# Altium schematic sheet [SCH]_Power.SchDoc: MOTHERBOARD
size 297 x 209 mm; CheckedBy: THIEN-KEMC; CompanyName: TEAM GA MO; DrawnBy: Vo Hao Hao; Organization: TEAM GA MO; Address1: TEAM GA MO Limited; Address2: 30, Nhat Hamet, Thanh Hoa, Phung Hiep, HG; TGM_Number: TGA-00005-01-1; Projet: EGG INCUBATION (PC-BASED MEASUREMENT AND CONTROL SYSTEMS); ModifiedBy: -; CreateDate: XX/XX/XXXX; CheckedDate: -; Title2: POWER SUPPLY LV; DivGrp: TGM; Designer: Vo Hao Hao
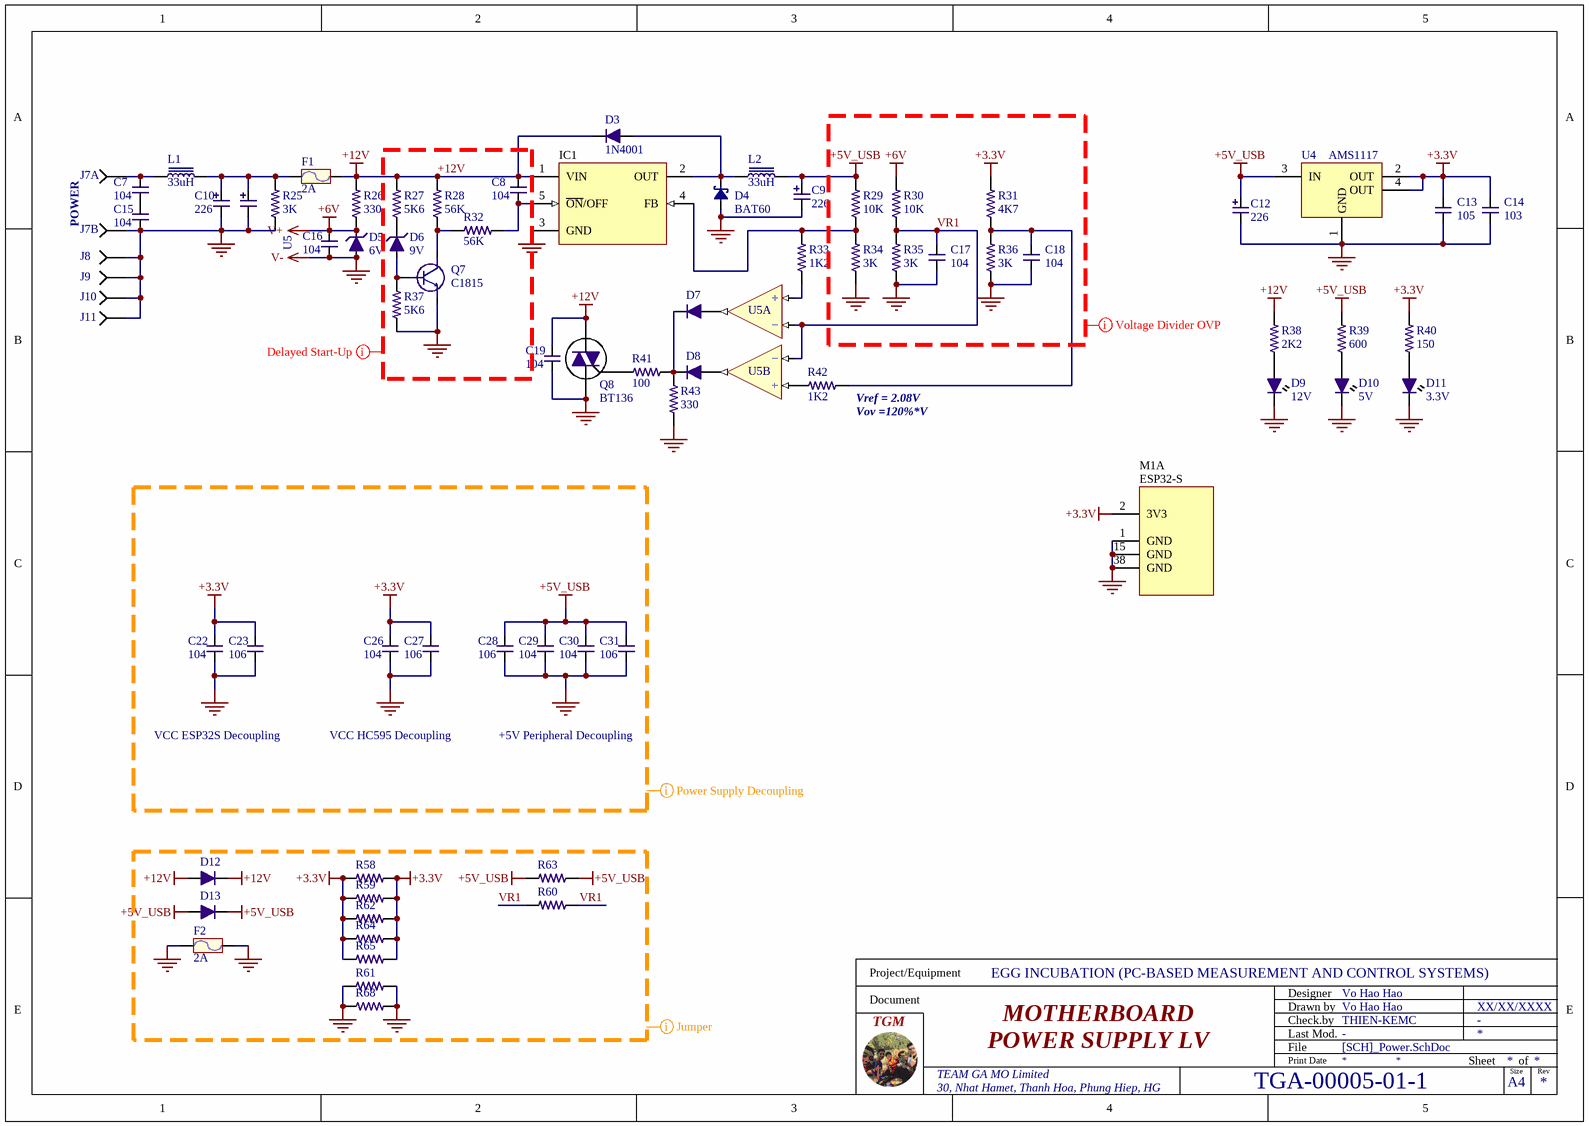
[diagram p0: [SCH]_Power.SchDoc]

## Parts
C7  104  [CAP-SMD-0805]
C8  104  [CAP-SMD-0805]
C9  226  [CAP-SMD-2512]
C10  226  [CAP-SMD-2512]
C11  226  [CAP-SMD-2512]  (value not drawn)
C12  226  [CAP-SMD-2512]
C13  105  [CAP-SMD-0805]
C14  103  [CAP-SMD-0805]
C15  104  [CAP-SMD-0805]
C16  104  [CAP-SMD-0805]
C17  104  [CAP-SMD-0805]
C18  104  [CAP-SMD-0805]
C19  104  [CAP-SMD-0805]
C22  104  [CAP-SMD-0805]
C23  106  [CAP-SMD-0805]
C26  104  [CAP-SMD-0805]
C27  106  [CAP-SMD-0805]
C28  106  [CAP-SMD-0805]
C29  104  [CAP-SMD-0805]
C30  104  [CAP-SMD-0805]
C31  106  [CAP-SMD-0805]
D3  1N4001  [DIO-SMD-123]
D4  BAT60  [DIO-SMD-106]
D5  6V  [DIO-SMD-123]
D6  9V  [DIO-SMD-123]
D7  1N4001  [DIO-SMD-123]  (value not drawn)
D8  1N4001  [DIO-SMD-123]  (value not drawn)
D9  12V  [LED0603-IPC]
D10  5V  [LED0603-IPC]
D11  3.3V  [LED0603-IPC]
D12  1N4001  [DIO-SMD-123]  (value not drawn)
D13  1N4001  [DIO-SMD-123]  (value not drawn)
F1  2A  [Fuse-SMD 1813]
F2  2A  [Fuse-SMD 1813]
IC1  LM2596  [TO263]  (value not drawn)
J7  POWER  [KF2/5.08]  (value not drawn)  (parts A,B of 2)
J8  MASS 3MM  [MY_PAD_3MM]  (value not drawn)
J9  MASS 3MM  [MY_PAD_3MM]  (value not drawn)
J10  MASS 3MM  [MY_PAD_3MM]  (value not drawn)
J11  MASS 3MM  [MY_PAD_3MM]  (value not drawn)
L1  33uH  [5026_INDUCTOR]
L2  33uH  [5026_INDUCTOR]
M1  ESP32-S  [ESP32-S-Footprint]  (part A of 4)
Q7  C1815  [SOT23(123)]
Q8  BT136  [TO252AA]
R25  value 3K  [RES-SMD-0805]  (hidden comment: R0805)
R26  value 330  [RES-SMD-0805]  (hidden comment: R0805)
R27  value 5K6  [RES-SMD-0805]  (hidden comment: R0805)
R28  value 56K  [RES-SMD-0805]  (hidden comment: R0805)
R29  value 10K  [RES-SMD-0805]  (hidden comment: R0805)
R30  value 10K  [RES-SMD-0805]  (hidden comment: R0805)
R31  value 4K7  [RES-SMD-0805]  (hidden comment: R0805)
R32  value 56K  [RES-SMD-0805]  (hidden comment: R0805)
R33  value 1K2  [RES-SMD-0805]  (hidden comment: R0805)
R34  value 3K  [RES-SMD-0805]  (hidden comment: R0805)
R35  value 3K  [RES-SMD-0805]  (hidden comment: R0805)
R36  value 3K  [RES-SMD-0805]  (hidden comment: R0805)
R37  value 5K6  [RES-SMD-0805]  (hidden comment: R0805)
R38  value 2K2  [RES-SMD-0805]  (hidden comment: R0805)
R39  value 600  [RES-SMD-0805]  (hidden comment: R0805)
R40  value 150  [RES-SMD-0805]  (hidden comment: R0805)
R41  value 100  [RES-SMD-0805]  (hidden comment: R0805)
R42  value 1K2  [RES-SMD-0805]  (hidden comment: R0805)
R43  value 330  [RES-SMD-0805]  (hidden comment: R0805)
R58  R0805  [RES-SMD-0805]  (value not drawn)
R59  R0805  [RES-SMD-0805]  (value not drawn)
R60  R0805  [RES-SMD-0805]  (value not drawn)
R61  R0805  [RES-SMD-0805]  (value not drawn)
R62  R0805  [RES-SMD-2512]  (value not drawn)
R63  R0805  [RES-SMD-2512]  (value not drawn)
R64  R0805  [RES-SMD-2512]  (value not drawn)
R65  R0805  [RES-SMD-2512]  (value not drawn)
R68  R0805  [RES-SMD-0805]  (value not drawn)
U4  AMS1117  [SOT223(1234)]
U5  LM358  [SOIC-8S]  (value not drawn)  (parts A,B of 2)

## Nets
+3.3V: C13.2 C14.2 C22.2 C23.2 C26.2 C27.2 M1.2(3V3) R31.2 R40.2 R58.1 R58.2 R59.1 R59.2 R62.1 R62.2 R64.1 R64.2 R65.1 R65.2 U4.2(OUT) U4.4(OUT)
+5V_USB: C9.1 C12.1 C28.2 C29.2 C30.2 C31.2 D13.1 D13.2 L2.2 R29.2 R39.2 R63.1 R63.2 U4.3(IN)
+6V: C16.2 D5.2 R26.1 R30.2 U5.8(V+)  [also labelled V+]
+12V: C8.2 C19.2 D3.2 D12.1 D12.2 F1.2 IC1.1(VIN) Q8.2(T2) R26.2 R27.2 R28.2 R38.2
GND: C9.2 C10.2 C11.2 C12.2 C13.1 C14.1 C15.1 C16.1 C17.1 C18.1 C19.1 C22.1 C23.1 C26.1 C27.1 C28.1 C29.1 C30.1 C31.1 D4.1 D5.1 D9.K D10.K D11.K F2.1 F2.2 IC1.3(GND) J7.2 J8.0 J9.0 J10.0 J11.0 M1.1(GND) M1.15(GND) M1.38(GND) Q7.3(E) Q8.1(T1) R25.1 R34.1 R35.1 R36.1 R37.1 R43.1 R61.1 R61.2 R68.1 R68.2 U4.1(GND) U5.4(V-)  [also labelled V-]
VR1: C17.2 R30.1 R35.2 R60.1 R60.2 U5.2(-IN) U5.6(-IN)
NetC7_1: C7.1 C15.2
NetC7_2: C7.2 J7.1 L1.1
NetC8_1: C8.1 IC1.5(~{ON}/OFF) R32.1
NetC10_1: C10.1 C11.1 F1.1 L1.2 R25.2
NetC18_2: C18.2 R31.1 R36.2 R42.1
NetD3_1: D3.1 D4.2 IC1.2(OUT) L2.1
NetD6_1: D6.1 Q7.1(B) R37.2
NetD6_2: D6.2 R27.1
NetD7_1: D7.1 U5.1(OUT)
NetD7_2: D7.2 D8.2 R41.2 R43.2
NetD8_1: D8.1 U5.7(OUT)
NetD9_A: D9.A R38.1
NetD10_A: D10.A R39.1
NetD11_A: D11.A R40.1
NetIC1_4: IC1.4(FB) R29.1 R33.2 R34.2
NetQ7_2: Q7.2(C) R28.1 R32.2
NetQ8_3: Q8.3(G) R41.1
NetR33_1: R33.1 U5.3(+IN)
NetR42_2: R42.2 U5.5(+IN)

## Layout directives
mark named Delayed Start-Up: +12V, GND
mark named Voltage Divider OVP: +3.3V, +5V_USB, +6V, GND, VR1
mark named Power Supply Decoupling: +3.3V, +5V_USB, GND
mark named Jumper: +3.3V, +5V_USB, +12V, GND, VR1

## Notes on the sheet
- (near J7) POWER
- U5
- (near R42) Vref = 2.08V
- (near R42) Vov =120%*V
- VCC ESP32S Decoupling
- VCC HC595 Decoupling
- +5V Peripheral Decoupling
- Project/Equipment
- Document
- Designer
- Drawn by
- Check.by
- File
- Last Mod.
- Print Date
- Sheet
- Size
- A4
- of
- Rev

## Library data of the parts
C7 C8 C13-C19 C22 C23 C26-C31 = Cap-Non-SMD: Non-polar capacitor
C9-C12 = Cap-Pol-SMD: Non-polar capacitor
D3 D7 D8 D12 D13 = 1N4001: 1.0A RECTIFIER; ComponentLink1Description: Datasheet; ComponentLink1URL: E:\NEW_DATA\ELECTRONIC_DOCUMENT\DATASHEET\1N4001 (2).pdf; Price: 0.006
D4 = BAT60: DIODE SCHOTTKY 10V 3A SOD323-2; Supplier 1: Digi-Key; Supplier Part Number 1: BAT60BE6327HTSA1CT-ND; Price: 0.008
D5 D6 = ZENER: DIODE-ZNR 5.1V 5% PD=1W IR=10uA; Manufacturer: Littlefuse Inc.; Manufacturer’s ordering code: SMF22A; Value: 24.4V; Part Number: SMF22A; Supplier 1: Digi-Key; Supplier 2: Mouser; Supplier Part Number 1: F5822CT-ND; Supplier Part Number 2: 576-SMF22A; Supplier 3: LCSC; Supplier Part Number 3: C169431
D9 = LED 0603 Red: LED RED CLEAR 0603 SMD VF 1.8; Supplier 1: Digi-Key; Supplier Part Number 1: 732-4979-1-ND
D10 = LED 0603 Yellow: LED YELLOW CLEAR 0603 SMD VF 1.85; Supplier 1: Digi-Key; Supplier Part Number 1: 732-4981-1-ND
D11 = LED 0603 Green: LED GREEN CLEAR 0603 SMD VF 2.5V; Supplier 1: Digi-Key; Supplier Part Number 1: 732-4971-1-ND
F1 F2 = Fuse SMD
IC1 = LM2596: Power IC; Max Input Voltage: 12 V; Max Output Current: 3 (6.0 peak) A; Max Output Voltage: mV; Category: IC-Power; Min Input Voltage: mV; Min Output Voltage: mV; Mounting Technology: Surface Mount; Status: Unreleased; Supply Voltage: mV; Temperature Range: -40 to +125 degC
J7 = JP2_IN
J8-J11 = JP1_IN: 3MM PAD
L1 L2 = INDUCTOR_FE: 2.2µH Shielded Wirewound Inductor 8.2A 10mOhm Max Nonstandard, 4 Lead; Supplier 1: Digi-Key; Supplier 2: Mouser; Supplier Part Number 1: 811-3603-1-ND; Supplier Part Number 2: 580-482R2SC; Value: 33uH
M1 = ESP32-S: Tensilica Xtensa LX6 microprocessor @ 160 or 240 MHz · 320 KiB SRAM; Bandwidth: 72 MHz; Data Rate: 150 Mbps; Interface: Ethernet, I2C, I2S, SPI, UART; Supply Voltage: 2.7 ~ 3.6 V; Number of ADC Channels: 16; Number of GPIO: 32; Nominal Supply Current: 500 mA; Number of cores: 2; Max CPU Freq: 240 MHz; CPU Name: ESP32-D0WDQ6; ComponentLink1Description: PCB; ComponentLink1URL: https://evertdekker.com/wp/?p=854; Temperature Range: -40 to +85 degC; Height: 3.2 mm
Q7 = NPN: Transistor, NPN, RF, 50mA, 12V; Supplier 1: Digi-Key; Supplier Part Number 1: 568-11514-1-ND
Q8 = SCR: THYRISTOR-TRIAC TO-220AB VRRM=600
R25-R43 = RES: Chip Resistor, 0805, 1%, 1/8 W; Supplier Part Number 1: 311-1.00KLRCT-ND; PackageReference: J1-0805; PackageDescription: Chip Resistor; Price: 0.005
R58-R61 R68 = RES: Chip Resistor, 0805, 1%, 1/8 W; Value: 0; Supplier Part Number 1: 311-1.00KLRCT-ND; PackageReference: J1-0805; PackageDescription: Chip Resistor; Price: 0.005
R62-R65 = RES: Chip Resistor, 0805, 1%, 1/8 W; Value: 1.0; Supplier Part Number 1: 311-1.00KLRCT-ND; PackageReference: J1-0805; PackageDescription: Chip Resistor; Price: 0.005
U4 = AMS1117: 1A Bipolar Linear Regulator; ComponentLink1Description: Datasheet; ComponentLink1URL: E:\NEW_DATA\ELECTRONIC_DOCUMENT\DATASHEET\AMS1117-1-2_C475600.pdf
U5 = LM358: 7mV 250nA 7uV/C 1MHz 0.6V/uS 0.8mA 3-32V; Price: 0.24